# Altium schematic sheet Ethernet.SchDoc
size A4; SheetNumber: 5; SheetTotal: 10
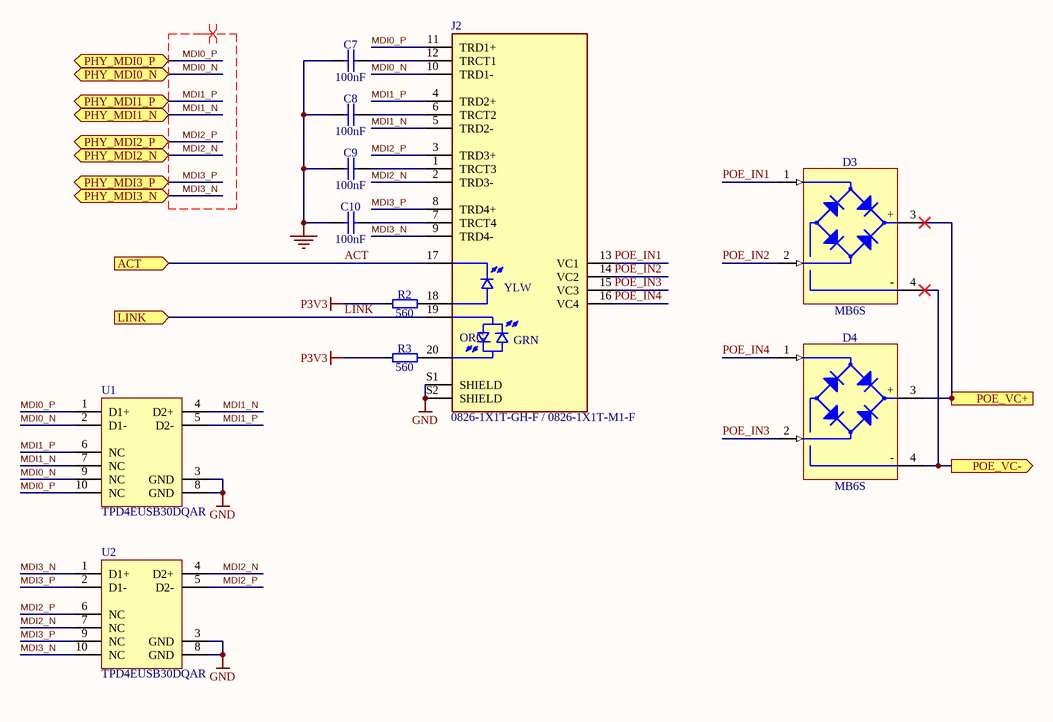
[diagram p0: Ethernet.SchDoc]

## Parts
C7  100nF  [CAPC1005X55N]
C8  100nF  [CAPC1005X55N]
C9  100nF  [CAPC1005X55N]
C10  100nF  [CAPC1005X55N]
D3  MB6S  [SOIC254P665X290-4N]
D4  MB6S  [SOIC254P665X290-4N]
J2  0826-1X1T-GH-F / 0826-1X1T-M1-F  [BEL_0826-1X1T-GH-F]
R2  560  [RESC1005X40N]
R3  560  [RESC1005X40N]
U1  TPD4EUSB30DQAR  [DQA0010A_V]
U2  TPD4EUSB30DQAR  [DQA0010A_V]

## Ports
ACT (in), LINK (in), PHY_MDI0_N (bidir), PHY_MDI0_P (bidir), PHY_MDI1_N (bidir), PHY_MDI1_P (bidir), PHY_MDI2_N (bidir), PHY_MDI2_P (bidir), PHY_MDI3_N (bidir), PHY_MDI3_P (bidir), POE_VC+ (out), POE_VC- (out)

## Nets
GND: C7.1 C8.1 C9.1 C10.1 J2.S1(SHIELD) J2.S2(SHIELD) U1.3(GND) U1.8(GND) U2.3(GND) U2.8(GND)
P3V3: R2.1 R3.1
ACT: J2.17 ; port ACT
LINK: J2.19 ; port LINK
MDI0_N: J2.10(TRD1-) U1.2(D1-) U1.9(NC) ; port PHY_MDI0_N
MDI0_P: J2.11(TRD1+) U1.1(D1+) U1.10(NC) ; port PHY_MDI0_P
MDI1_N: J2.5(TRD2-) U1.4(D2+) U1.7(NC) ; port PHY_MDI1_N
MDI1_P: J2.4(TRD2+) U1.5(D2-) U1.6(NC) ; port PHY_MDI1_P
MDI2_N: J2.2(TRD3-) U2.4(D2+) U2.7(NC) ; port PHY_MDI2_N
MDI2_P: J2.3(TRD3+) U2.5(D2-) U2.6(NC) ; port PHY_MDI2_P
MDI3_N: J2.9(TRD4-) U2.1(D1+) U2.10(NC) ; port PHY_MDI3_N
MDI3_P: J2.8(TRD4+) U2.2(D1-) U2.9(NC) ; port PHY_MDI3_P
POE_IN1: D3.1(AC) J2.13(VC1)
POE_IN2: D3.2(AC) J2.14(VC2)
POE_IN3: D4.2(AC) J2.15(VC3)
POE_IN4: D4.1(AC) J2.16(VC4)
POE_VC+: D3.3(+) D4.3(+) ; port POE_VC+
POE_VC-: D3.4(-) D4.4(-) ; port POE_VC-
NetC7_2: C7.2 J2.12(TRCT1)
NetC8_2: C8.2 J2.6(TRCT2)
NetC9_2: C9.2 J2.1(TRCT3)
NetC10_2: C10.2 J2.7(TRCT4)
NetJ2_18: J2.18 R2.2
NetJ2_20: J2.20 R3.2

## Layout directives
differential pair: MDI0_N, MDI0_P, MDI1_N, MDI1_P, MDI2_N, MDI2_P, MDI3_N, MDI3_P

## Notes on the sheet
- (in symbol 0826-1X1T-GH-F) YLW; ORG; GRN

## Library data of the parts
C7-C10 = CC0402_100NF_16V_10%_X5R: Non-polarised capacitor; Manufacturer: GENERIC; Part Description: SMD Multilayer Chip Ceramic Capacitor; Manufacturer1 Part Number: GRM155R61C104KA88D; Tolerance: ±10%; Voltage: 16V; TC: X5R; Manufacturer Part Number: CC0402_100NF_16V_10%_X5R; Part Number: CC0402_100NF_16V_10%_X5R; Value: 100nF; Component Kind: Standard; Component Type: Standard; Pin Count: 2; Status: None; Case: 0402; Mounted: Yes; Socket: No; SMD: Yes; Sense: No; Manufacturer1 Example: MURATA; Manufacturer1 ComponentHeight: 0.55mm; HelpURL: \\cern.ch\dfs\Applications\Altium\Datasheets\CC0402_X5R_MURATA_GRM.pdf; Author: CERN DEM JLC; CreateDate: 10.12.2013; LatestRevisionDate: 10.12.2013
D3 D4 = MB6S: Bridge Rectifier 1AC 2AC 3+ 4-; Part Description: Miniature Glass Passivated Fast Recovery Surface Mount Bridge Rectifier; Manufacturer: VISHAY GENERAL SEMICONDUCTOR; Voltage: 600V; Power: 0.5A; PressFit: No; Bonding: No; Part Number: MB6S; Component Kind: Standard; Component Type: Standard; Device: MB6S; PackageDescription: SOIC, 4-Leads, Body 3.9x4.75mm, Pitch 2.54mm, IPC Medium Density; Manufacturer Part Number: MB6S; Pin Count: 4; Case: SOIC4; Mounted: Yes; Socket: No; SMD: Yes; Sense: No; ComponentHeight: 2.9mm; HelpURL: \\cern.ch\dfs\Applications\Altium\Datasheets\MB6S.pdf; Author: CERN DEM MR; CreateDate: 15.04.2016; LatestRevisionDate: 15.04.2016
J2 = 0826-1X1T-GH-F: MagJack 1000BASE-T | PoE+ | 1X1 | OG/Y | -40 to 85C | Tab Up | RoHS; MF: Bel Magnetic Solutions; Value: *; Availability: Unavailable; Package: None; Price: None; SnapEDA_Link: https://www.snapeda.com/parts/0826-1X1T-GH-F/Bel%20Magnetic%20Solutions/view-part/417678/?ref=snap; MP: 0826-1X1T-GH-F
R2 R3 = R0402_560R_1%_0.0625W_100PPM: Resistor - 1%; Part Description: General Purpose Thick Film Chip Resistor; Manufacturer: GENERIC; Manufacturer1 Part Number: 232270675601L; TC: ±100ppm/°C; PressFit: No; Part Number: R0402_560R_1%_0.0625W_100PPM; Component Kind: Standard; Component Type: Standard; Pin Count: 2; Value: 560; Status: Not Recommended; Power: 0.0625W; Tolerance: ±1%; Manufacturer Part Number: R0402_560R_1%_0.0625W_100PPM; Case: 0402; Mounted: Yes; Sense: No; Socket: No; SMD: Yes; Manufacturer1 Example: YAGEO PHYCOMP; Manufacturer1 ComponentHeight: 0.4mm; HelpURL: \\cern.ch\dfs\Applications\Altium\Datasheets\R0402_Phycomp_RC0402.pdf; Author: CERN DEM JLC; CreateDate: 03.12.2007; LatestRevisionDate: 17.10.2012
U1 U2 = CMP-0326-00027-3: ESD Solution for Super-Speed (6 GBPS) USB 3.0 Interface, 4 Channels, -40 to +85 degC, 10-pin SON (DQA), Green (RoHS & no Sb/Br); Manufacturer: Texas Instruments; Differential Capacitance(pF): 0.05; Serial ATA / eSATA: TRUE; IO Capacitance(Typ)(pF): 0.8; IO Leakage Current(nA): 10; IEC 61000-4-2 Air-Gap(+/- kV): 8; ComponentLink3Description: URL Link1; PartNumber: TPD4EUSB30DQAR; DatasheetVersion: SLVSAC2C; ComponentLink2URL: http://www.ti.com/general/docs/lit/getliterature.tsp?genericPartNumber=TPD4EUSB30&fileType=pdf; USB Super Speed: TRUE; Eco-Plan: Green (RoHS & no Sb/Br); Mounting Technology: Surface Mount; 1394 / Firewire: TRUE; PackageVersion: revB, Sep-2009; SubFamily: ESD Solution; USB Full Speed: TRUE; USB High Speed: TRUE; ComponentLink2Description: Datasheet; ComponentLink1URL: http://www.ti.com/; IEC 61000-4-2 Contact(+/- kV): 8; Breakdown Voltage(Min)(V): 8; PackageReference: DQA0010A; ComponentLink1Description: Manufacturer URL; PackageDescription: 10-Pin Plastic Small Outline No-Lead, 1 x 2.5 x 0.55 mm Body, 0.5 mm Pitch; ComponentLink3URL: SamplesURL:http://www.ti.com/product/tpd4eusb30#samples; HDMI: TRUE